# Altium project Digital_To_Analog_Converter.PrjPcb
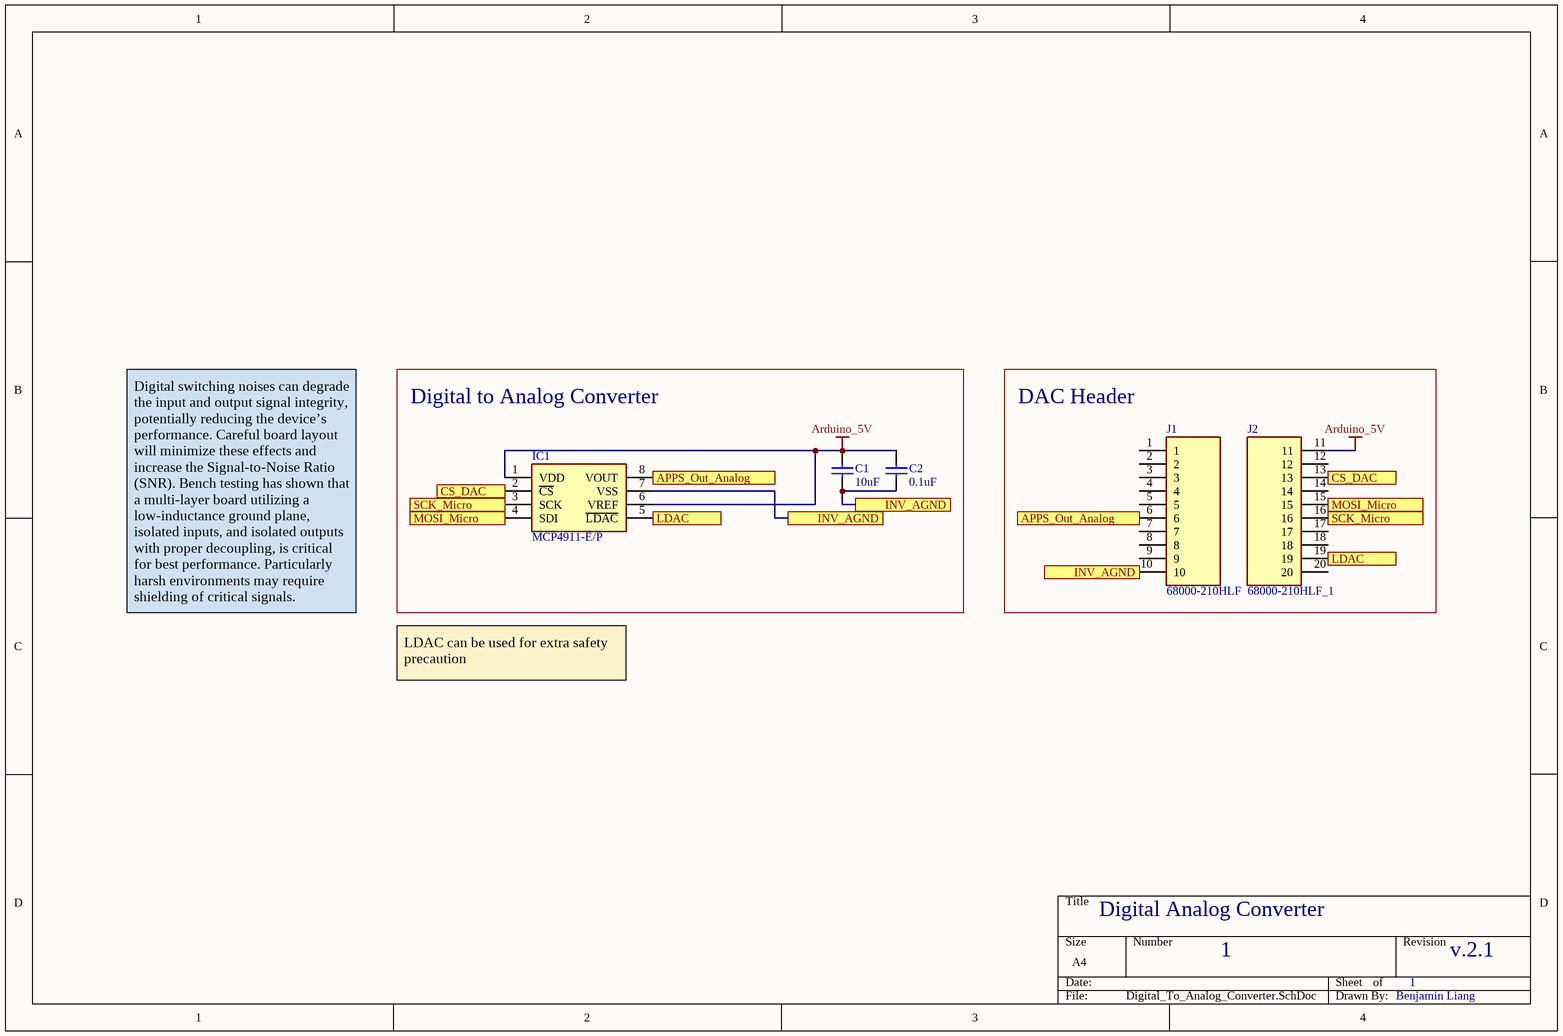
[diagram p0: Digital_To_Analog_Converter.SchDoc]
1 sheet, 5 parts. Net scope: flat (ports and power ports of the same name join across sheets).
Board file: Digital_To_Analog_Converter.PcbDoc

## Sheet Digital_To_Analog_Converter.SchDoc
size A4; SheetNumber: 1; SheetTotal: 1

### Parts
C1  10uF  [C1206]
C2  0.1uF  [C1206]
IC1  MCP4911-E/P  [DIP781W56P254L950H533Q8N]
J1  68000-210HLF  [HDRV10W63P0X254_1X10_2540X241X858P]
J2  68000-210HLF_1  [HDRV10W63P0X254_1X10_2540X241X858P]

### Blocks framed on the sheet
Digital to Analog Converter: C1 C2 IC1
DAC Header: J1 J2

### Ports
APPS_Out_Analog, CS_DAC, INV_AGND, LDAC, MOSI_Micro, SCK_Micro

### Nets
Arduino_5V: C1.1 C2.1 IC1.1(VDD) IC1.6(VREF) J2.11
NetC1_2: C1.2 C2.2 IC1.7(VSS) J1.10 ; port INV_AGND
NetIC1_2: IC1.2(~{CS}) J2.13 ; port CS_DAC
NetIC1_3: IC1.3(SCK) J2.16 ; port SCK_Micro
NetIC1_4: IC1.4(SDI) J2.15 ; port MOSI_Micro
NetIC1_5: IC1.5(~{LDAC}) J2.19 ; port LDAC
NetIC1_8: IC1.8(VOUT) J1.6 ; port APPS_Out_Analog

Not connected (* = marked no-connect by the designer): J1 1 2 3 4 5 7 8 9; J2 12 14 17 18 20

### Notes on the sheet
- Digital switching noises can degrade the input and output signal integrity, potentially reducing the device’s performance. Careful board layout will minimize these effects and increase the Signal-to-Noise Ratio (SNR). Bench testing has shown that a multi-layer board utilizing a low-inductance ground plane, isolated inputs, and isolated outputs with proper decoupling, is critical for best performance. Particularly harsh environments may require shielding of critical signals.
- LDAC can be used for extra safety precaution
- Digital Analog Converter
- 1
- v.2.1
- Benjamin Liang

### Library data of the parts
C1 C2 = Cap Semi: Capacitor (Semiconductor SIM Model); Value: 100nF; Published: 8-Jun-2000; LatestRevisionDate: 29-May-2009; LatestRevisionNote: IPC-7351 Footprint Added.; PackageReference: C1206; Publisher: Altium Limited; PackageDescription: Chip Capacitor
IC1 = MCP4911-E_P: Integrated Circuit; Manufacturer_Name: Microchip; Datasheet Link: http://uk.rs-online.com/web/p/products/7263882; Height: 5.334mm; Manufacturer_Part_Number: MCP4911-E/P; Mouser Part Number: 579-MCP4911-E/P; Mouser Price/Stock: https://www.mouser.co.uk/ProductDetail/Microchip-Technology/MCP4911-E-P?qs=bxUt0k7cytJWZspBfmPK%2Fg%3D%3D; Arrow Part Number: MCP4911-E/P; Arrow Price/Stock: https://www.arrow.com/en/products/mcp4911-ep/microchip-technology?region=nac
J1 = 68000-210HLF: Connector; Manufacturer_Name: Amphenol; Datasheet Link: https://cdn.amphenol-icc.com/media/wysiwyg/files/drawing/68000.pdf; Height: 8.58mm; Manufacturer_Part_Number: 68000-210HLF; Mouser Part Number: 649-68000-210HLF; Mouser Price/Stock: https://www.mouser.co.uk/ProductDetail/Amphenol-FCI/68000-210HLF?qs=QKvFUfBIyQINb7f%2F4SDc2A%3D%3D; Arrow Part Number: 68000-210HLF; Arrow Price/Stock: https://www.arrow.com/en/products/68000-210hlf/amphenol-fci
J2 = 68000-210HLF_1: Connector; Manufacturer_Name: Amphenol; Datasheet Link: https://cdn.amphenol-icc.com/media/wysiwyg/files/drawing/68000.pdf; Height: 8.58mm; Manufacturer_Part_Number: 68000-210HLF; Mouser Part Number: 649-68000-210HLF; Mouser Price/Stock: https://www.mouser.co.uk/ProductDetail/Amphenol-FCI/68000-210HLF?qs=QKvFUfBIyQINb7f%2F4SDc2A%3D%3D; Arrow Part Number: 68000-210HLF; Arrow Price/Stock: https://www.arrow.com/en/products/68000-210hlf/amphenol-fci